# EasyEDA Pro project Speaker Switch 2.epro

# Schematic Speaker Switch
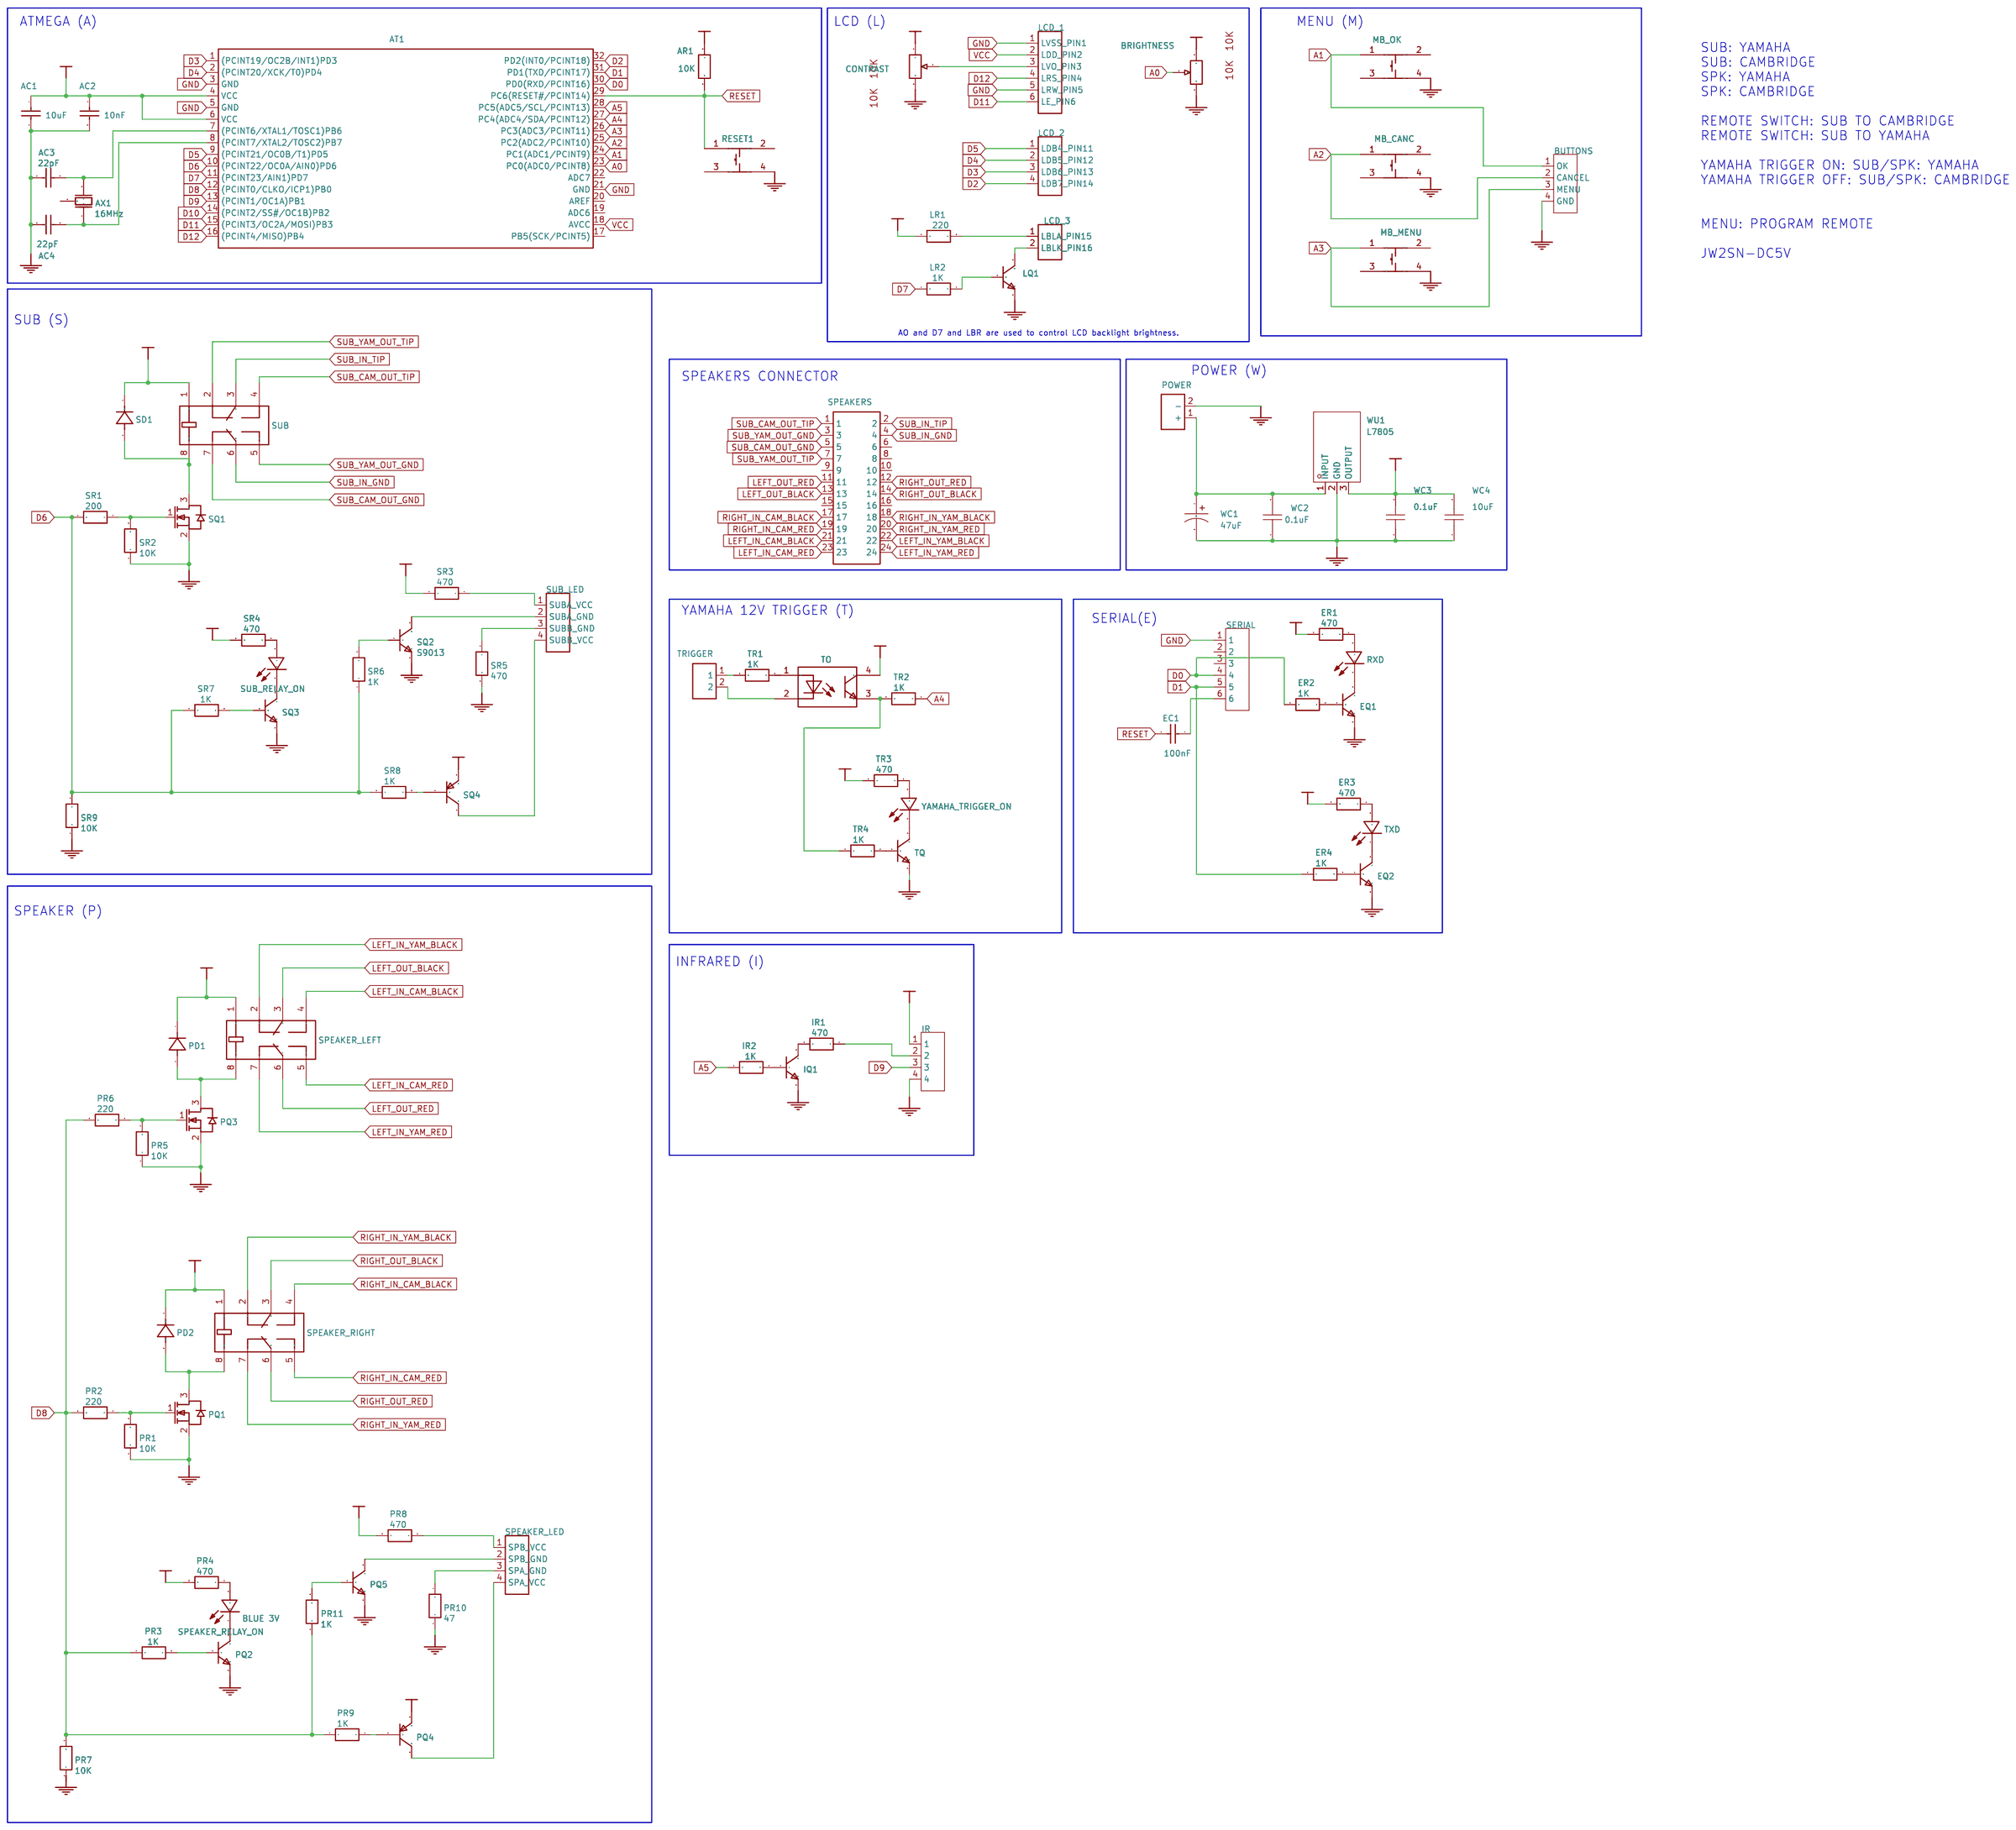
[diagram p0: schematic sheet]

## Parts
AC1  10uF  [C0805]
AC2  10nF  [C0805]
AC3  22pF  [C0805]
AC4  22pF  [C0805]
AR1  10K  [R0805]
AT1  ATMEGA328P-AU  [TQFP-32_L7.0-W7.0-P0.80-LS9.0-BL]
AX1  16MHz  [OSC-SMD_3P-L3.2-W1.3-P1.2-L]
BRIGHTNESS  potentiometer  [POTENTIOMETER]
BUTTONS  AXH-4A-11  [CONN-TH_KH-XH-4A-Z]
CONTRAST  potentiometer  [POTENTIOMETER]
EC1  100nF  [C0805]
EQ1  S9013  [SOT-23-3_L2.9-W1.6-P1.90-LS2.8-BR]
EQ2  S9013  [SOT-23-3_L2.9-W1.6-P1.90-LS2.8-BR]
ER1  470  [R0805]
ER2  1K  [R0805]
ER3  470  [R0805]
ER4  1K  [R0805]
IQ1  S9013  [SOT-23-3_L2.9-W1.6-P1.90-LS2.8-BR]
IR  AXH-4A-11  [CONN-TH_KH-XH-4A-Z]
IR1  470  [R0805]
IR2  1K  [R0805]
LCD_1  XD-XH-6A-G  [CONN-TH_XH-6A]
LCD_2  AXH-4A-11  [CONN-TH_KH-XH-4A-Z]
LCD_3  XH-D-2A  [CONN-TH_XH-2A]
LQ1  S9013  [SOT-23-3_L2.9-W1.6-P1.90-LS2.8-BR]
LR1  220  [R0805]
LR2  1K  [R0805]
MB_CANC  Push Button  [PUSH_BUTTON-SMD_4P]
MB_MENU  Push Button  [PUSH_BUTTON-SMD_4P]
MB_OK  Push Button  [PUSH_BUTTON-SMD_4P]
PD1  S1M_C3011098  [SMA_L4.3-W2.6-LS5.0-RD]
PD2  S1M_C3011098  [SMA_L4.3-W2.6-LS5.0-RD]
POWER  XH-D-2A  [CONN-TH_XH-2A]
PQ1  2N7002-G  [SOT-23-3_L2.9-W1.6-P1.90-LS2.8-BR]
PQ2  S9013  [SOT-23-3_L2.9-W1.6-P1.90-LS2.8-BR]
PQ3  2N7002-G  [SOT-23-3_L2.9-W1.6-P1.90-LS2.8-BR]
PQ4  S8550  [SOT-23-3_L2.9-W1.3-P1.90-LS2.4-BR]
PQ5  S9013  [SOT-23-3_L2.9-W1.6-P1.90-LS2.8-BR]
PR1  10K  [R0805]
PR2  220  [R0805]
PR3  1K  [R0805]
PR4  470  [R0805]
PR5  10K  [R0805]
PR6  220  [R0805]
PR7  10K  [R0805]
PR8  470  [R0805]
PR9  1K  [R0805]
PR10  47  [R0805]
PR11  1K  [R0805]
RESET1  Push Button  [PUSH_BUTTON-SMD_4P]
RXD  BLUE 3V  [LED0805-RD]
SD1  S1M_C3011098  [SMA_L4.3-W2.6-LS5.0-RD]
SERIAL  2.54-1*6  [HDR-TH_6P-P2.54-V-M]
SPEAKER_LED  AXH-4A-11  [CONN-TH_KH-XH-4A-Z]
SPEAKER_LEFT  JW2SN-DC5V  [RELAY-TH_JW2SN-DCXXV]
SPEAKER_RELAY_ON  BLUE 3V  [LED0805-RD]
SPEAKER_RIGHT  JW2SN-DC5V  [RELAY-TH_JW2SN-DCXXV]
SQ1  2N7002-G  [SOT-23-3_L2.9-W1.6-P1.90-LS2.8-BR]
SQ2  S9013  [SOT-23-3_L2.9-W1.6-P1.90-LS2.8-BR]
SQ3  S9013  [SOT-23-3_L2.9-W1.6-P1.90-LS2.8-BR]
SQ4  S8550  [SOT-23-3_L2.9-W1.3-P1.90-LS2.4-BR]
SR1  200  [R0805]
SR2  10K  [R0805]
SR3  470  [R0805]
SR4  470  [R0805]
SR5  470  [R0805]
SR6  1K  [R0805]
SR7  1K  [R0805]
SR8  1K  [R0805]
SR9  10K  [R0805]
SUB  JW2SN-DC5V  [RELAY-TH_JW2SN-DCXXV]
SUB_LED  AXH-4A-11  [CONN-TH_KH-XH-4A-Z]
SUB_RELAY_ON  BLUE 3V  [LED0805-RD]
TO  LTV-817S-TA1-C  [OPTO-SMD-4_L4.6-W6.5-P2.54-LS10.3-BL]
TQ  S9013  [SOT-23-3_L2.9-W1.6-P1.90-LS2.8-BR]
TR1  1K  [R0805]
TR2  1K  [R0805]
TR3  470  [R0805]
TR4  1K  [R0805]
TRIGGER  XH-2A_C3012117  [CONN-TH_XH-2A]
TXD  BLUE 3V  [LED0805-RD]
U1  SPEAKERS  [CONN-TH_C4255WV-2X12P]
WC1  47uF  [CAP-TH_BD6.3-P2.5-D0.5]
WC2  0.1uF  [C0805]
WC3  0.1uF  [C0805]
WC4  10uF  [C0805]
WU1  L7805  [TO-220-3_L10.0-W4.5-P2.54-L]
YAMAHA_TRIGGER_ON  BLUE 3V  [LED0805-RD]

## Library data of the parts
AC1 = 10uF: Supplier: LCSC; Manufacturer: YAGEO; Manufacturer Part: CC0805KKX7R9BB105; Supplier Part: C91185; JLCPCB Part Class: Extended Part; nameAlias: Capacitance; spicePre: C; spiceSymbolName: CC0805KKX7R9BB105
AC2 = 10nF: Supplier: LCSC; Manufacturer: YAGEO; Manufacturer Part: CC0805KKX7R9BB105; Supplier Part: C91185; JLCPCB Part Class: Extended Part; nameAlias: Capacitance; spicePre: C; spiceSymbolName: CC0805KKX7R9BB105
AC3 AC4 = 22pF: Supplier: LCSC; Manufacturer: YAGEO; Manufacturer Part: CC0805KKX7R9BB105; Supplier Part: C91185; JLCPCB Part Class: Extended Part; nameAlias: Capacitance; spicePre: C; spiceSymbolName: CC0805KKX7R9BB105
AR1 ER2 ER4 IR2 PR3 PR9 PR11 SR3 SR6-SR8 TR1 TR2 TR4 = 1K: Supplier: Mouser; Supplier Part: 756-WCR0805-1K0FI; Manufacturer: Walsin Tech Corp; Manufacturer Part: WR08X102 JTL; nameAlias: Resistance (Ohms); Contributor: LCSC; spicePre: R; spiceSymbolName: WR08X102 JTL; Package Display: No
AT1 = ATMEGA328P-AU: Supplier: LCSC; Manufacturer: MICROCHIP; Supplier Part: C14877; JLCPCB Part Class: Basic Part; spicePre: U
AX1 = 16MHz: Supplier: LCSC; Supplier Part: C341521; Manufacturer: Murata Electronics; Manufacturer Part: CSTNE16M0V530000R0; JLCPCB Part Class: Extended Part; nameAlias: Frequency; Contributor: LCSC; spicePre: X; spiceSymbolName: CSTNE16M0V530000R0
BRIGHTNESS CONTRAST = potentiometer: Contributor: sausnet 1975; spicePre: U
BUTTONS = AXH-4A-11-BTN: Pins Structure:1x4P Pitch:2.5mm Mounting Type:Through Hole Reference Series:XH Number of Pins:4P Number of Rows:1 Number of PINs Per Row:4 Row Spacing:2.5mm Current Rating:2A Contact Material:Brass Contact Plating:Tin Operating Temperature:-25℃~+85℃ Opera; LCSC Part Name: 1x4P 间距:2.5mm 直插 系列:XH; Supplier Part: C42422439; Manufacturer: JXTCONN(聚兴泰); Supplier Footprint: 插件,P=2.54mm; JLCPCB Part Class: Extended Part; Datasheet: https://item.szlcsc.com/datasheet/AXH-4A-11/44442050.html; Supplier: LCSC; Pins Structure: 1x4P; Pitch: 2.5mm; Mounting Type: Through Hole; Reference Series: XH; Number of Pins: 4P; Number of Rows: 1; Number of PINs Per Row: 4; Row Spacing: 2.5mm; Current Rating: 2A; Contact Material: Brass; Contact Plating: Tin; Operating Temperature: -25℃~+85℃; Voltage Rating: 250V; Plastic Material: PA66; Flame Retardant Rating: UL94V-0; Color: White; Z-Height of the Board: 7mm; X-Length of Bottom Edge on Board (Spacing Line): 12.5mm; Y-Width of Bottom Edge on Board: 5.9mm
EC1 = 100nF: Supplier: LCSC; Manufacturer: YAGEO; Manufacturer Part: CC0805KKX7R9BB105; Supplier Part: C91185; JLCPCB Part Class: Extended Part; nameAlias: Capacitance; spicePre: C; spiceSymbolName: CC0805KKX7R9BB105
EQ1 EQ2 IQ1 LQ1 PQ2 PQ5 SQ2 SQ3 TQ = S9013: Supplier: LCSC; Manufacturer: CJ; Manufacturer Part: S9013 120-200; Supplier Part: C107404; JLCPCB Part Class: Extended Part; spicePre: Q; spiceSymbolName: S9013 120-200; Package Display: No
ER1 ER3 IR1 LR1 PR2 PR4 PR6 PR8 PR10 SR1 SR4 TR3 = 220: Supplier: Mouser; Supplier Part: WCR0805-220RFI; Manufacturer: Walsin Tech Corp; Manufacturer Part: WR08X102 JTL; nameAlias: Resistance (Ohms); Contributor: LCSC; spicePre: R; spiceSymbolName: WR08X102 JTL; Package Display: No
IR LCD_2 = AXH-4A-11: Pins Structure:1x4P Pitch:2.5mm Mounting Type:Through Hole Reference Series:XH Number of Pins:4P Number of Rows:1 Number of PINs Per Row:4 Row Spacing:2.5mm Current Rating:2A Contact Material:Brass Contact Plating:Tin Operating Temperature:-25℃~+85℃ Opera; LCSC Part Name: 1x4P 间距:2.5mm 直插 系列:XH; Supplier Part: C42422439; Manufacturer: JXTCONN(聚兴泰); Supplier Footprint: 插件,P=2.54mm; JLCPCB Part Class: Extended Part; Datasheet: https://item.szlcsc.com/datasheet/AXH-4A-11/44442050.html; Supplier: LCSC; Pins Structure: 1x4P; Pitch: 2.5mm; Mounting Type: Through Hole; Reference Series: XH; Number of Pins: 4P; Number of Rows: 1; Number of PINs Per Row: 4; Row Spacing: 2.5mm; Current Rating: 2A; Contact Material: Brass; Contact Plating: Tin; Operating Temperature: -25℃~+85℃; Voltage Rating: 250V; Plastic Material: PA66; Flame Retardant Rating: UL94V-0; Color: White; Z-Height of the Board: 7mm; X-Length of Bottom Edge on Board (Spacing Line): 12.5mm; Y-Width of Bottom Edge on Board: 5.9mm
LCD_1 = XD-XH-6A-G: Supplier: LCSC; Supplier Part: C17700950; Manufacturer: XUNDA(讯答); JLCPCB Part Class: Extended Part; Contributor: lcsc; spicePre: U
LCD_3 = XH-D-2A: Supplier: LCSC; Supplier Part: C5160911; Manufacturer: DEALON(德艺隆); JLCPCB Part Class: Extended Part; Contributor: lcsc; spicePre: C
LR2 = 1K: Supplier: Mouser; Supplier Part: 756-WCR0805-470RFI; Manufacturer: Walsin Tech Corp; Manufacturer Part: WR08X102 JTL; nameAlias: Resistance (Ohms); Contributor: LCSC; spicePre: R; spiceSymbolName: WR08X102 JTL; Package Display: No
MB_CANC MB_MENU MB_OK RESET1 = Push Button: Supplier: Office; Contributor: Smart; spicePre: S
PD1 PD2 SD1 = S1M_C3011098: Supplier: Mouser; Supplier Part: 603-S1M; Manufacturer: YAGEO; Manufacturer Part: S1M; JLCPCB Part Class: Extended Part; Contributor: lcsc; spicePre: D
POWER = XH-D-2A-POWER: Supplier: LCSC; Supplier Part: C5160911; Manufacturer: DEALON(德艺隆); JLCPCB Part Class: Extended Part
PQ1 PQ3 SQ1 = 2N7002-G: Supplier: Mouser; Supplier Part: 637-2N7002; Manufacturer: Diotec Semiconductor; JLCPCB Part Class: Extended Part; Contributor: LCSC; spicePre: Q
PQ4 SQ4 = S8550: Supplier: LCSC; Supplier Part: C2828467; Manufacturer: CBI(创基); Contributor: LCSC; spicePre: Q; spiceSymbolName: S8550_C2828467
PR1 PR5 SR2 SR9 = 10K: Supplier: Mouser; Supplier Part: WCR0805-10KFI; Manufacturer: Walsin Tech Corp; Manufacturer Part: WR08X102 JTL; nameAlias: Resistance (Ohms); Contributor: LCSC; spicePre: R; spiceSymbolName: WR08X102 JTL; Package Display: No
PR7 = 10K: Supplier: LCSC; Supplier Part: C384174; Manufacturer: Walsin Tech Corp; Manufacturer Part: WR08X102 JTL; nameAlias: Resistance (Ohms); Contributor: LCSC; spicePre: R; spiceSymbolName: WR08X102 JTL; Package Display: No
RXD SPEAKER_RELAY_ON SUB_RELAY_ON TXD YAMAHA_TRIGGER_ON = BLUE 3V: Supplier: LCSC; Manufacturer: NATIONSTAR; Manufacturer Part: FC-1608YOXK-600H08; Supplier Part: C108553; JLCPCB Part Class: Extended Part; Contributor: LCSC; spicePre: L; spiceSymbolName: FC-1608YOXK-600H08
SERIAL = 2.54-1*6: Pin Structure:1x6P Pitch:2.54mm Circluar Pins/Square Pins:Pin Header Mounting Type:Through Hole Number of Rows:1 Number of Pins:6P Current Rating:2.5A Length of Mating Pin:6mm Insulation Height:2.54mm Length of End Connection Pin:3mm Contact Material:Bras; LCSC Part Name: 1x6P 间距:2.54mm 方针 直插; Supplier Part: C5156615; Manufacturer: ZHOURI(洲日); Supplier Footprint: 插件,P=2.54mm; JLCPCB Part Class: Extended Part; Datasheet: https://item.szlcsc.com/datasheet/2.54-1*6/5790715.html; Supplier: LCSC; Pin Structure: 1x6P; Pitch: 2.54mm; Circluar Pins/Square Pins: Pin Header; Mounting Type: Through Hole; Number of Rows: 1; Number of Pins: 6P; Current Rating: 2.5A; Length of Mating Pin: 6mm; Insulation Height: 2.54mm; Length of End Connection Pin: 3mm; Contact Material: Brass; Contact Plating: Gold; Operating Temperature: -40℃~+105℃
SPEAKER_LED SUB_LED = AXH-4A-11: Supplier: LCSC; Supplier Part: C42422439; Manufacturer: JXTCONN(聚兴泰); JLCPCB Part Class: Extended Part; Contributor: lcsc; spicePre: C
SPEAKER_LEFT SPEAKER_RIGHT SUB = JW2SN-DC5V: Supplier: Mouser; Supplier Part: 769-JW2SN-DC5V; Manufacturer: PANASONIC(松下); JLCPCB Part Class: Extended Part; Contributor: LCSC; spicePre: K
SR5 = 300: Supplier: LCSC; Supplier Part: C384174; Manufacturer: Walsin Tech Corp; Manufacturer Part: WR08X102 JTL; nameAlias: Resistance (Ohms); Contributor: LCSC; spicePre: R; spiceSymbolName: WR08X102 JTL; Package Display: No
TO = LTV-817S-TA1-C: Supplier: Mouser; Manufacturer: LITEON(光宝); JLCPCB Part Class: Basic Part; spicePre: U
TRIGGER = XH-2A_C3012117: Supplier: LCSC; Supplier Part: C3012117; Manufacturer: HCTL(华灿天禄); Manufacturer Part: XH-2A; JLCPCB Part Class: Extended Part; Contributor: lcsc; spicePre: C
U1 = SPEAKERS: Supplier: LCSC; Supplier Part: C9900031500; Manufacturer: null; Manufacturer Part: ATX-24PIN; JLCPCB Part Class: Extended Part; Contributor: lcsc; spicePre: U; spiceSymbolName: ATX-24PIN
WC1 = 50V47uF CD288: Capacitance:47uF Tolerance:±20% Tolerance:±20% Voltage Rating:50V Pin Spacing:2.5mm Diameter:6.3mm Height - Seated (Max):12mm Operating Temperature:-40℃~+105℃ Operating Temperature:-40℃~+105℃; LCSC Part Name: 47uF ±20% 50V; Supplier Part: C2960223; Manufacturer: HRK(鸿瑞凯电子); Supplier Footprint: 插件,D6.3xL12mm; JLCPCB Part Class: Extended Part; Supplier: LCSC; Tolerance: ±20%; Voltage Rating: 50V; Pin Spacing: 2.5mm; Diameter: 6.3mm; Height - Seated (Max): 12mm; Operating Temperature: -40℃~+105℃
WC2-WC4 = CT41G-0805-2X1-50V-0.1uF-K(N): Capacitance:100nF Tolerance:±10% Tolerance:±10% Voltage Rating:50V Temperature Coefficient:-; LCSC Part Name: 100nF ±10% 50V; Supplier Part: C126469; Manufacturer: TORCH(火炬); Supplier Footprint: 0805; JLCPCB Part Class: Extended Part; Datasheet: https://item.szlcsc.com/datasheet/CT41G-0805-2X1-50V-0.1uF-K(N)/137749.html; Supplier: LCSC; Tolerance: ±10%; Voltage Rating: 50V
WU1 = L7805_C22378639: Output Type:Fixed Voltage - Supply:20V Output Voltage:5V Output Voltage:5V Output Current:1.2A Power Supply Rejection Ratio (PSRR):73dB@(120Hz) Voltage Dropout:2V@(1A) standby current:500uA Noise:42uV Features:Short Circuit Protection Operating Temperatur; LCSC Part Name: 1.2A 5V稳压管; Supplier Part: C22378639; Manufacturer: OSEN(欧芯); Supplier Footprint: TO-220ST; JLCPCB Part Class: Extended Part; Datasheet: https://item.szlcsc.com/datasheet/L7805/23899839.html; Supplier: LCSC; Output Type: Fixed; Voltage - Supply: 20V; Output Voltage: 5V; Output Current: 1.2A; Power Supply Rejection Ratio (PSRR): 73dB@(120Hz); Voltage Dropout: 2V@(1A); standby current: 500uA; Noise: 42uV; Features: Short Circuit Protection; Operating Temperature: 0℃~+125℃@(Tj); Output Configuration: Positive; Number of Outputs: 1

## Nets
GND: AC1.2 AC2.2 AC3.1 AC4.1 AT1.3(GND) AT1.5(GND) AT1.21(GND) BRIGHTNESS.1 BUTTONS.4(GND) CONTRAST.3 EQ1.2 EQ2.2 IQ1.2 IR.4 LCD_1.1(LVSS_PIN1) LCD_1.5(LRW_PIN5) LQ1.2 MB_CANC.4 MB_MENU.4 MB_OK.4 POWER.2(-) PQ1.2(S) PQ2.2 PQ3.2(S) PQ5.2 PR1.1 PR5.1 PR7.1 PR10.2 RESET1.4 SERIAL.1 SQ1.2(S) SQ2.2 SQ3.2 SR2.1 SR5.2 SR9.1 TQ.2 WC1.2 WC2.1 WC3.1 WC4.1 WU1.2(GND)
VCC: AC1.1 AC2.1 AR1.2 AT1.4(VCC) AT1.6(VCC) AT1.18(AVCC) BRIGHTNESS.3 CONTRAST.1 ER1.2 ER3.2 IR.1 LCD_1.2(LDD_PIN2) LR1.1 PD1.1(C) PD2.1(C) PQ4.2(E) PR4.2 PR8.2 SD1.1(C) SPEAKER_LEFT.1 SPEAKER_RIGHT.1 SQ4.2(E) SR3.2 SR4.2 SUB.1 TO.4 TR3.2 WC3.2 WC4.2 WU1.3(OUTPUT)
A0: AT1.23(PC0(ADC0/PCINT8)) BRIGHTNESS.2
A1: AT1.24(PC1(ADC1/PCINT9)) BUTTONS.1(OK) MB_OK.1
A2: AT1.25(PC2(ADC2/PCINT10)) BUTTONS.2(CANCEL) MB_CANC.1
A3: AT1.26(PC3(ADC3/PCINT11)) BUTTONS.3(MENU) MB_MENU.1
A4: AT1.27(PC4(ADC4/SDA/PCINT12)) TR2.1
A5: AT1.28(PC5(ADC5/SCL/PCINT13)) IR2.1
D0: AT1.30(PD0(RXD/PCINT16)) ER2.1 SERIAL.4
D1: AT1.31(PD1(TXD/PCINT17)) ER4.1 SERIAL.5
D2: AT1.32(PD2(INT0/PCINT18)) LCD_2.4(LDB7_PIN14)
D3: AT1.1((PCINT19/OC2B/INT1)PD3) LCD_2.3(LDB6_PIN13)
D4: AT1.2((PCINT20/XCK/T0)PD4) LCD_2.2(LDB5_PIN12)
D5: AT1.9((PCINT21/OC0B/T1)PD5) LCD_2.1(LDB4_PIN11)
D6: AT1.10((PCINT22/OC0A/AIN0)PD6) SR1.2 SR6.1 SR7.1 SR8.1 SR9.2
D7: AT1.11((PCINT23/AIN1)PD7) LR2.1
D8: AT1.12((PCINT0/CLKO/ICP1)PB0) PR2.2 PR3.1 PR6.2 PR7.2 PR9.1 PR11.1
D9: AT1.13((PCINT1/OC1A)PB1) IR.3
D10: AT1.14((PCINT2/SS#/OC1B)PB2)
D11: AT1.15((PCINT3/OC2A/MOSI)PB3) LCD_1.6(LE_PIN6)
D12: AT1.16((PCINT4/MISO)PB4) LCD_1.4(LRS_PIN4)
LEFT_IN_CAM_BLACK: SPEAKER_LEFT.4 U1.21
LEFT_IN_CAM_RED: SPEAKER_LEFT.5 U1.23
LEFT_IN_YAM_BLACK: SPEAKER_LEFT.2 U1.22
LEFT_IN_YAM_RED: SPEAKER_LEFT.7 U1.24
LEFT_OUT_BLACK: SPEAKER_LEFT.3 U1.13
LEFT_OUT_RED: SPEAKER_LEFT.6 U1.11
RESET: AR1.1 AT1.29(PC6(RESET#/PCINT14)) EC1.2 RESET1.1
RIGHT_IN_CAM_BLACK: SPEAKER_RIGHT.4 U1.17
RIGHT_IN_CAM_RED: SPEAKER_RIGHT.5 U1.19
RIGHT_IN_YAM_BLACK: SPEAKER_RIGHT.2 U1.18
RIGHT_IN_YAM_RED: SPEAKER_RIGHT.7 U1.20
RIGHT_OUT_BLACK: SPEAKER_RIGHT.3 U1.14
RIGHT_OUT_RED: SPEAKER_RIGHT.6 U1.12
SUB_CAM_OUT_GND: SUB.7 U1.5
SUB_CAM_OUT_TIP: SUB.4 U1.1
SUB_IN_GND: SUB.6 U1.4
SUB_IN_TIP: SUB.3 U1.2
SUB_YAM_OUT_GND: SUB.5 U1.3
SUB_YAM_OUT_TIP: SUB.2 U1.7
$1N2: AC4.2 AT1.8((PCINT7/XTAL2/TOSC2)PB7) AX1.1(OSC1)
$1N3: AC3.2 AT1.7((PCINT6/XTAL1/TOSC1)PB6) AX1.3(OSC2)
$1N9: LCD_3.2(LBLK_PIN16) LQ1.3
$1N11: LQ1.1 LR2.2
$1N13: LCD_3.1(LBLA_PIN15) LR1.2
$1N18: CONTRAST.2 LCD_1.3(LVO_PIN3)
$1N24: SQ2.3 SUB_LED.2(SUBA_GND)
$1N25: SR3.1 SUB_LED.1(SUBA_VCC)
$1N27: SQ2.1 SR6.2
$1N28: SQ4.1(B) SR8.2
$1N29: PQ4.1(B) PR9.2
$1N30: PQ5.1 PR11.2
$1N32: PR8.1 SPEAKER_LED.1(SPB_VCC)
$1N33: PQ5.3 SPEAKER_LED.2(SPB_GND)
$1N38: EC1.1 SERIAL.6
$1N45: TO.2 TRIGGER.2
$1N46: TO.3 TR2.2 TR4.1
$1N47: TR1.2 TRIGGER.1
$1N48: TO.1 TR1.1
$1N53: SD1.2(A) SQ1.3(D) SUB.8
$1N55: SQ3.1 SR7.2
$1N60: SR5.1 SUB_LED.3(SUBB_GND)
$1N61: SQ4.3(C) SUB_LED.4(SUBB_VCC)
$1N63: PD1.2(A) PQ3.3(D) SPEAKER_LEFT.8
$1N77: PD2.2(A) PQ1.3(D) SPEAKER_RIGHT.8
$1N80: PR10.1 SPEAKER_LED.3(SPA_GND)
$1N81: PQ4.3(C) SPEAKER_LED.4(SPA_VCC)
$1N82: PQ2.1 PR3.2
$1N84: PQ3.1(G) PR5.2 PR6.1
$1N86: PQ1.1(G) PR1.2 PR2.1
$1N88: SQ1.1(G) SR1.1 SR2.2
$1N2026: SR4.1 SUB_RELAY_ON.2(A)
$1N2027: SQ3.3 SUB_RELAY_ON.1(K)
$1N2090: PR4.1 SPEAKER_RELAY_ON.2(A)
$1N2093: PQ2.3 SPEAKER_RELAY_ON.1(K)
$1N2094: TR3.1 YAMAHA_TRIGGER_ON.2(A)
$1N2095: TQ.1 TR4.2
$1N2096: TQ.3 YAMAHA_TRIGGER_ON.1(K)
$1N2101: EQ1.1 ER2.2
$1N2102: ER1.1 RXD.2(A)
$1N2103: EQ1.3 RXD.1(K)
$1N2106: ER3.1 TXD.2(A)
$1N2109: EQ2.1 ER4.2
$1N2110: EQ2.3 TXD.1(K)
$1N11660: IQ1.1 IR2.2
$1N11678: IQ1.3 IR1.2
$1N11682: IR.2 IR1.1
PWR_IN: POWER.1(+) WC1.1 WC2.2 WU1.1(INPUT)

Not connected (* = marked no-connect by the designer): AT1 17(PB5(SCK/PCINT5)) 19(ADC6) 20(AREF) 22(ADC7); AX1 2(GND); MB_CANC 2 3; MB_MENU 2 3; MB_OK 2 3; RESET1 2 3; SERIAL 2 3; U1 6 8 9 10 15 16

## Notes on the sheet
- ATMEGA (A)
- LCD (L)
- MENU (M)
- SUB: YAMAHA
  SUB: CAMBRIDGE
  SPK: YAMAHA
  SPK: CAMBRIDGE
  REMOTE SWITCH: SUB TO CAMBRIDGE
  REMOTE SWITCH: SUB TO YAMAHA
  YAMAHA TRIGGER ON: SUB/SPK: YAMAHA
  YAMAHA TRIGGER OFF: SUB/SPK: CAMBRIDGE
  MENU: PROGRAM REMOTE
  JW2SN-DC5V
- SUB (S)
- AO and D7 and LBR are used to control LCD backlight brightness.
- SPEAKERS CONNECTOR
- POWER (W)
- YAMAHA 12V TRIGGER (T)
- SERIAL(E)
- SPEAKER (P)
- INFRARED (I)

# Board PCB
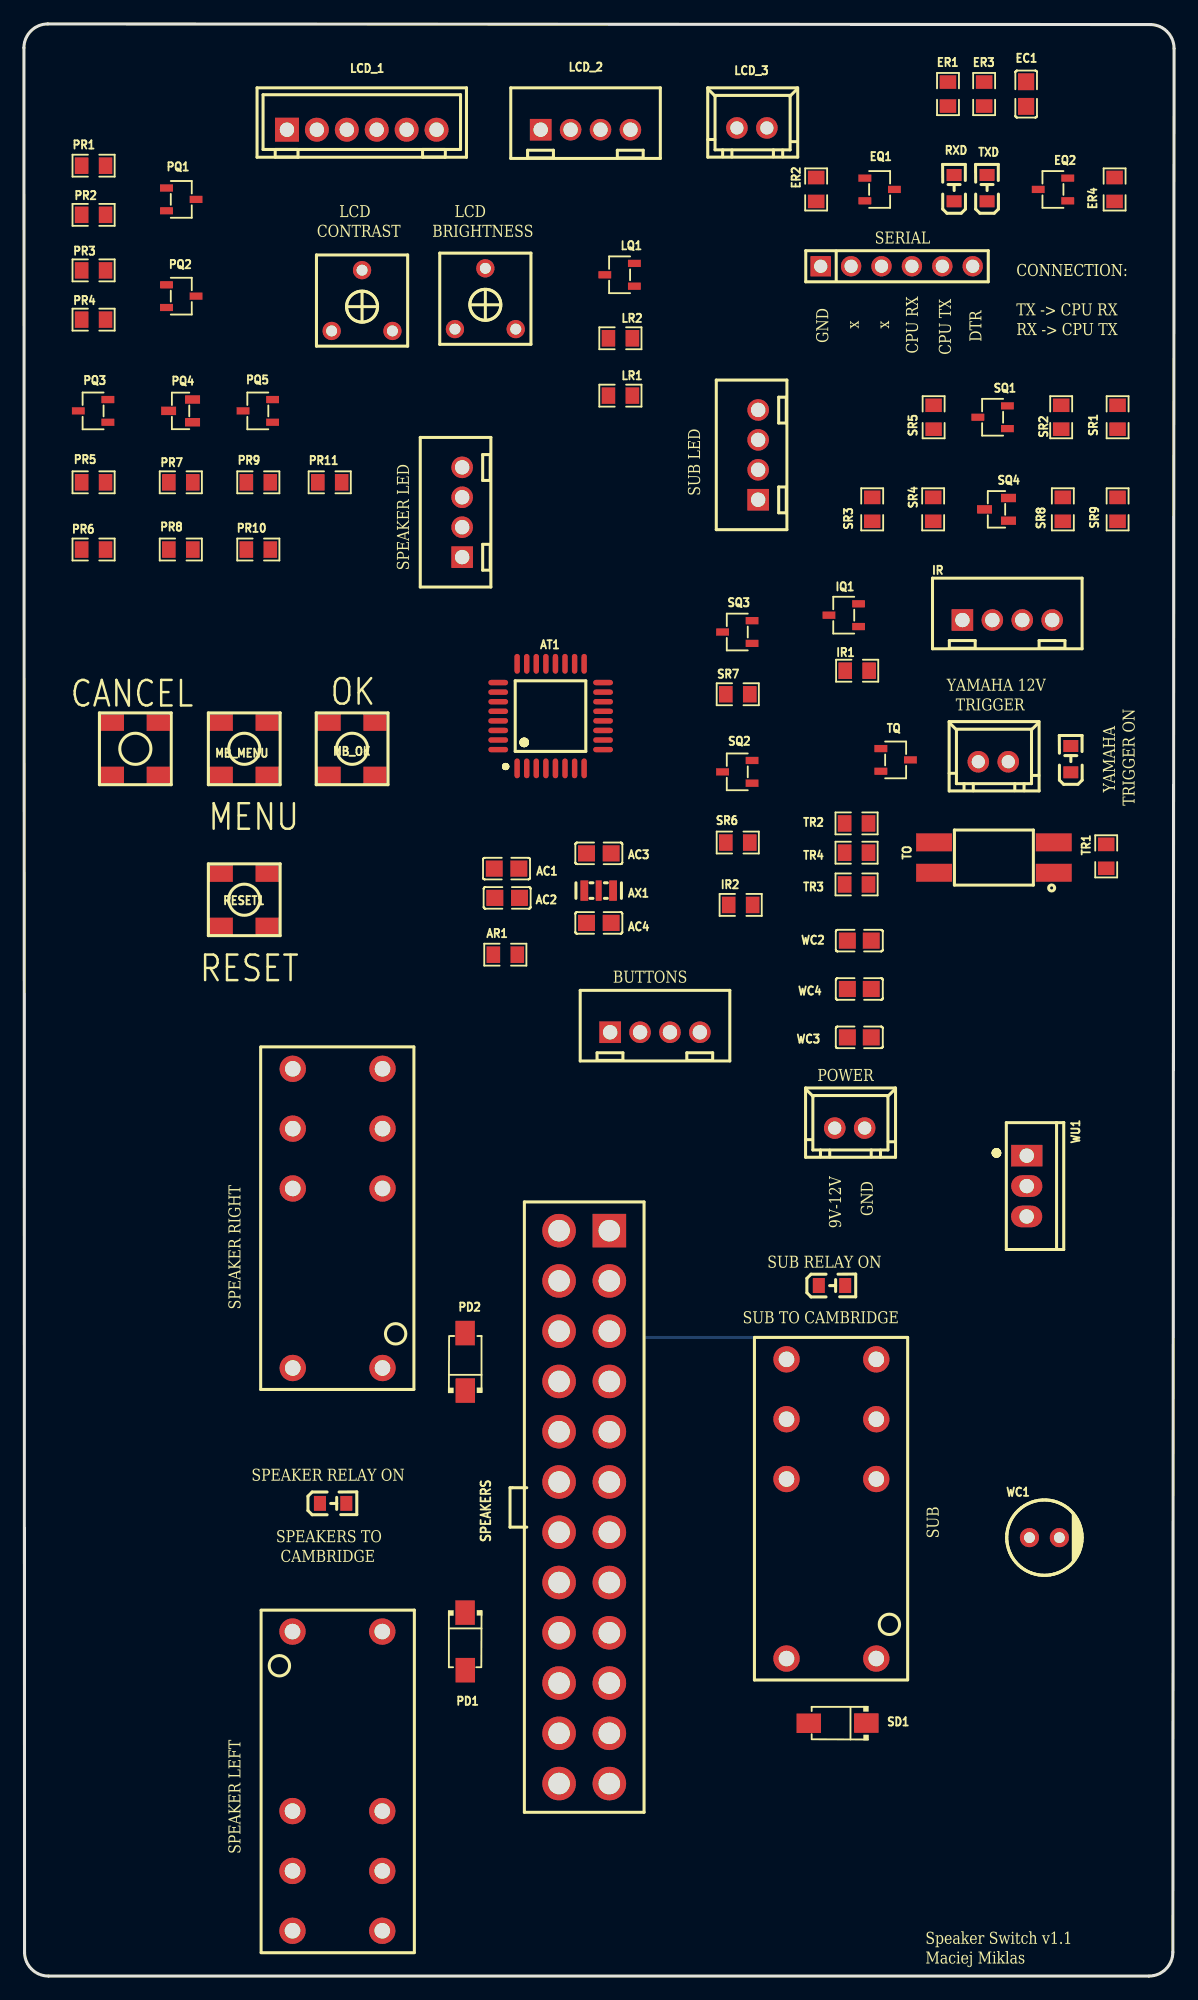
[diagram p1: board, top side]
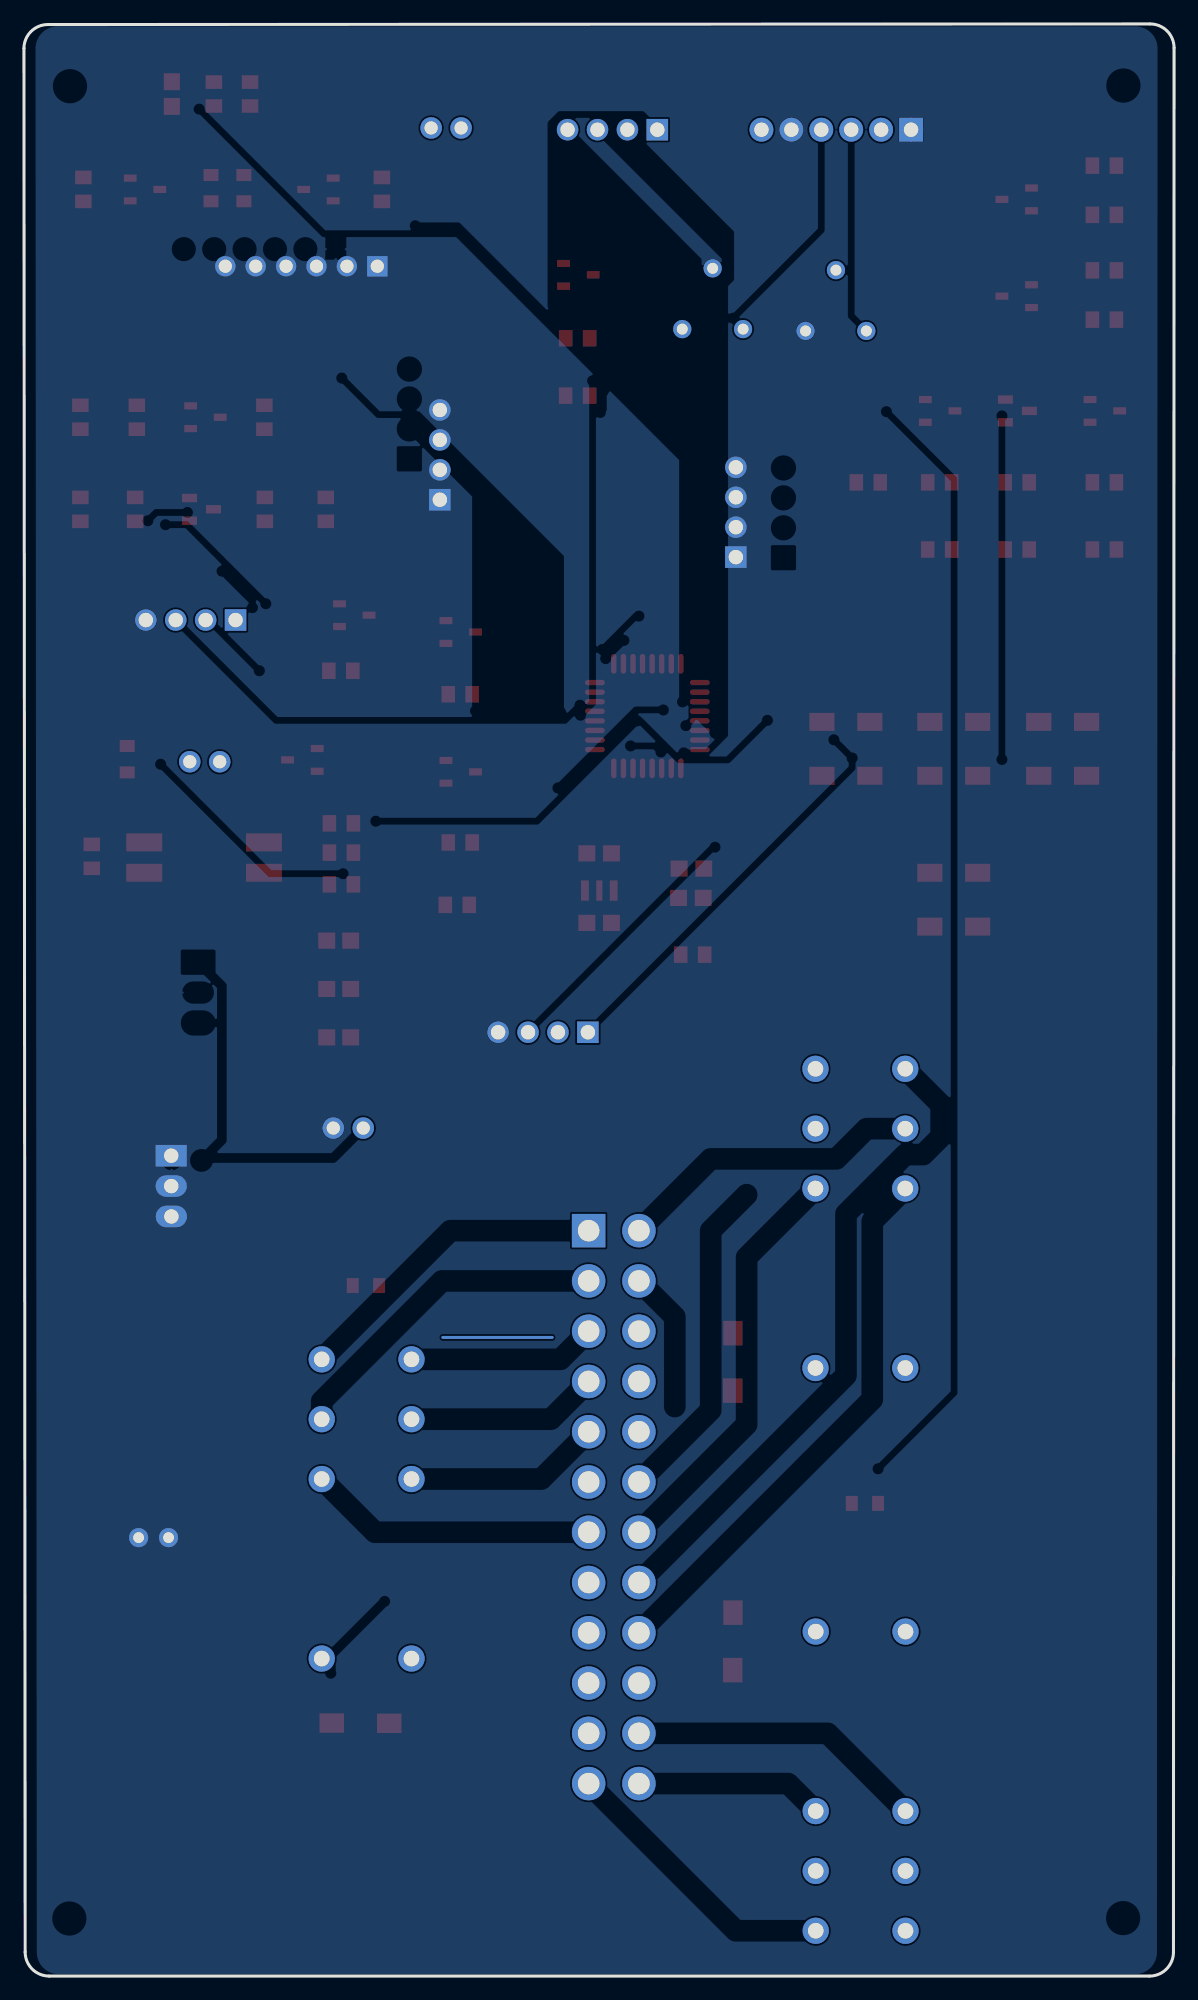
[diagram p2: board, bottom side, seen from below]

Outline 96.11 x 163.11 mm; copper layers: Top Layer, Bottom Layer. Coordinates in mm from the lower left corner of the outline.
Outline path: 0,161.11 arc(0.59,162.53) 2,163.11 94.11,163.06 arc(95.52,162.48) 96.11,161.06 96,2 arc(95.42,0.59) 94,0 2.05,0 arc(0.64,0.59) 0.05,2 0,161.11
Stack: Top Layer 0.035mm / Dielectric1 1.51mm FR4 er 4.5 / Bottom Layer 0.035mm

## Design rules (mm)
template: User Custom Config
spacing Default (default): track to track 0.152, other pairs 0 to 0.152
track width Default (default): min 0.254, default 0.254, max 25.4
track width power: min 0.5, default 0.5, max 2.54
track width speaker: min 1.5, default 1.5, max 2.54
track width mega_thick: min 5, default 5, max 5
differential pair differentialPair (default): width min 0.127, default 0.254, max 2.54; gap min 0.152, default 0.152
via Default (default): diameter min 0.61, default 0.61, max 100.025; hole min 0.305, default 0.305, max 59.995
net GND uses power
net VCC uses power
net SUB_IN_TIP uses speaker
net SUB_IN_GND uses speaker
net RIGHT_OUT_BLACK uses speaker
net LEFT_OUT_BLACK uses speaker
net RIGHT_OUT_RED uses speaker
net LEFT_OUT_RED uses speaker
net PWR_IN uses power

## Placement (name value [footprint] x y rotation side)
AC1  10uF  [C0805]  40.33 92.54 180 top
AC2  10nF  [C0805]  40.38 90.09 180 top
AC3  22pF  [C0805]  48.04 93.81 0 top
AC4  22pF  [C0805]  48.04 88 0 top
AR1  10K  [R0805]  40.22 85.35 0 top
AT1  ATMEGA328P-AU  [TQFP-32_L7.0-W7.0-P0.80-LS9.0-BL]  44.01 105.28 0 top
AX1  16MHz  [OSC-SMD_3P-L3.2-W1.3-P1.2-L]  48.03 90.7 180 top
BRIGHTNESS  potentiometer  [POTENTIOMETER]  38.56 137.61 0 top
BUTTONS  AXH-4A-11  [CONN-TH_KH-XH-4A-Z]  52.73 78.86 0 top
CONTRAST  potentiometer  [POTENTIOMETER]  28.25 137.46 0 top
EC1  100nF  [C0805]  83.75 157.25 90 top
EQ1  S9013  [SOT-23-3_L2.9-W1.6-P1.90-LS2.8-BR]  71.5 149.28 180 top
EQ2  S9013  [SOT-23-3_L2.9-W1.6-P1.90-LS2.8-BR]  85.99 149.28 0 top
ER1  470  [R0805]  77.21 157.25 90 top
ER2  1K  [R0805]  66.2 149.28 90 top
ER3  470  [R0805]  80.23 157.25 90 top
ER4  1K  [R0805]  91.14 149.28 270 top
IQ1  S9013  [SOT-23-3_L2.9-W1.6-P1.90-LS2.8-BR]  68.5 113.71 0 top
IR  AXH-4A-11  [CONN-TH_KH-XH-4A-Z]  82.17 113.3 0 top
IR1  470  [R0805]  69.62 109.07 0 top
IR2  1K  [R0805]  59.89 89.5 0 top
LCD_1  XD-XH-6A-G  [CONN-TH_XH-6A]  28.23 154.28 0 top
LCD_2  AXH-4A-11  [CONN-TH_KH-XH-4A-Z]  46.93 154.28 0 top
LCD_3  XH-D-2A  [CONN-TH_XH-2A]  60.83 154.42 0 top
LQ1  S9013  [SOT-23-3_L2.9-W1.6-P1.90-LS2.8-BR]  49.77 142.15 0 top
LR1  220  [R0805]  49.84 132.06 0 top
LR2  1K  [R0805]  49.84 136.85 0 top
MB_CANC  Push Button  [PUSH_BUTTON-SMD_4P]  9.31 102.55 0 top
MB_MENU  Push Button  [PUSH_BUTTON-SMD_4P]  18.41 102.55 0 top
MB_OK  Push Button  [PUSH_BUTTON-SMD_4P]  27.42 102.55 0 top
PD1  S1M_C3011098  [SMA_L4.3-W2.6-LS5.0-RD]  36.87 27.96 270 top
PD2  S1M_C3011098  [SMA_L4.3-W2.6-LS5.0-RD]  36.87 51.32 90 top
POWER  XH-D-2A  [CONN-TH_XH-2A]  69 70.86 0 top
PQ1  2N7002-G  [SOT-23-3_L2.9-W1.6-P1.90-LS2.8-BR]  13.15 148.45 180 top
PQ2  S9013  [SOT-23-3_L2.9-W1.6-P1.90-LS2.8-BR]  13.15 140.37 180 top
PQ3  2N7002-G  [SOT-23-3_L2.9-W1.6-P1.90-LS2.8-BR]  5.78 130.78 0 top
PQ4  S8550  [SOT-23-3_L2.9-W1.3-P1.90-LS2.4-BR]  13.09 130.78 0 top
PQ5  S9013  [SOT-23-3_L2.9-W1.6-P1.90-LS2.8-BR]  19.54 130.78 0 top
PR1  10K  [R0805]  5.82 151.27 180 top
PR2  220  [R0805]  5.82 147.16 0 top
PR3  1K  [R0805]  5.82 142.52 0 top
PR4  470  [R0805]  5.82 138.41 0 top
PR5  10K  [R0805]  5.82 124.81 180 top
PR6  220  [R0805]  5.82 119.2 0 top
PR7  10K  [R0805]  13.11 124.81 0 top
PR8  470  [R0805]  13.11 119.2 0 top
PR9  1K  [R0805]  19.58 124.81 0 top
PR10  47  [R0805]  19.58 119.2 0 top
PR11  1K  [R0805]  25.55 124.81 0 top
RESET1  Push Button  [PUSH_BUTTON-SMD_4P]  18.41 89.94 0 top
RXD  BLUE 3V  [LED0805-RD]  77.72 149.4 90 top
SD1  S1M_C3011098  [SMA_L4.3-W2.6-LS5.0-RD]  67.98 21.13 180 top
SERIAL  2.54-1*6  [HDR-TH_6P-P2.54-V-M]  72.93 142.87 0 top
SPEAKER_LED  AXH-4A-11  [CONN-TH_KH-XH-4A-Z]  36.62 122.31 90 top
SPEAKER_LEFT  JW2SN-DC5V  [RELAY-TH_JW2SN-DCXXV]  26.19 16.29 270 top
SPEAKER_RELAY_ON  BLUE 3V  [LED0805-RD]  25.83 39.5 0 top
SPEAKER_RIGHT  JW2SN-DC5V  [RELAY-TH_JW2SN-DCXXV]  26.21 63.31 90 top
SQ1  2N7002-G  [SOT-23-3_L2.9-W1.6-P1.90-LS2.8-BR]  80.94 130.25 0 top
SQ2  S9013  [SOT-23-3_L2.9-W1.6-P1.90-LS2.8-BR]  59.61 100.62 0 top
SQ3  S9013  [SOT-23-3_L2.9-W1.6-P1.90-LS2.8-BR]  59.61 112.3 0 top
SQ4  S8550  [SOT-23-3_L2.9-W1.3-P1.90-LS2.4-BR]  81.27 122.56 0 top
SR1  200  [R0805]  91.39 130.25 90 top
SR2  10K  [R0805]  86.67 130.25 270 top
SR3  470  [R0805]  70.88 122.56 270 top
SR4  470  [R0805]  75.97 122.56 90 top
SR5  470  [R0805]  76.01 130.25 270 top
SR6  1K  [R0805]  59.65 94.72 0 top
SR7  1K  [R0805]  59.65 107.11 0 top
SR8  1K  [R0805]  86.81 122.56 270 top
SR9  10K  [R0805]  91.39 122.56 270 top
SUB  JW2SN-DC5V  [RELAY-TH_JW2SN-DCXXV]  67.47 39.03 90 top
SUB_LED  AXH-4A-11  [CONN-TH_KH-XH-4A-Z]  61.35 127.11 90 top
SUB_RELAY_ON  BLUE 3V  [LED0805-RD]  67.52 57.7 0 top
TO  LTV-817S-TA1-C  [OPTO-SMD-4_L4.6-W6.5-P2.54-LS10.3-BL]  81.05 93.46 90 top
TQ  S9013  [SOT-23-3_L2.9-W1.6-P1.90-LS2.8-BR]  72.84 101.62 180 top
TR1  1K  [R0805]  90.43 93.56 90 top
TR2  1K  [R0805]  69.58 96.31 0 top
TR3  470  [R0805]  69.58 91.21 0 top
TR4  1K  [R0805]  69.58 93.87 180 top
TRIGGER  XH-2A_C3012117  [CONN-TH_XH-2A]  81 101.47 0 top
TXD  BLUE 3V  [LED0805-RD]  80.48 149.4 90 top
U1  SPEAKERS  [CONN-TH_C4255WV-2X12P]  46.82 39.18 90 top
WC1  47uF  [CAP-TH_BD6.3-P2.5-D0.5]  85.27 36.63 0 top
WC2  0.1uF  [C0805#2]  69.8 86.52 180 top
WC3  0.1uF  [C0805#2]  69.8 78.44 0 top
WC4  10uF  [C0805#2]  69.8 82.48 0 top
WU1  L7805  [TO-220-3_L10.0-W4.5-P2.54-L]  83.79 66.01 270 top
YAMAHA_TRIGGER_ON  BLUE 3V  [LED0805-RD]  87.48 101.68 90 top

## Footprints (pads in the part's own frame, mm; a bottom-side part is the same pattern mirrored in y, then rotated)
C0805
  rect 1.41x1.35 smd: 1(-1.03,0) 2(1.03,0)
C0805#2
  rect 1.41x1.35 smd: 1(-1,0) 2(1,0)
CAP-TH_BD6.3-P2.5-D0.5
  round 1.6 hole 0.9: 1(-1.25,0) 2(1.25,0)
CONN-TH_C4255WV-2X12P
  rect 2.8x2.8 hole 1.8: 1(23.1,-2.1)
  round 2.8 hole 1.8: 2(18.9,-2.1) 3(14.7,-2.1) 4(10.5,-2.1) 5(6.3,-2.1) 6(2.1,-2.1) 7(-2.1,-2.1) 8(-6.3,-2.1) 9(-10.5,-2.1) 10(-14.7,-2.1) 11(-18.9,-2.1) 12(23.1,2.1) 13(18.9,2.1) 14(14.7,2.1) 15(10.5,2.1) 16(6.3,2.1) 17(2.1,2.1) 18(-2.1,2.1) 19(-6.3,2.1) 20(-10.5,2.1) 21(-14.7,2.1) 22(-18.9,2.1) 23(-23.1,-2.1) 24(-23.1,2.1)
CONN-TH_KH-XH-4A-Z
  rect 1.8x1.8 hole 1.2: 1(-3.75,0)
  round 1.8 hole 1.2: 2(-1.25,0) 3(1.25,0) 4(3.75,0)
CONN-TH_XH-2A
  round 1.8 hole 1.1: 1(-1.251,0) 2(1.251,0)
CONN-TH_XH-6A
  rect 2x2 hole 1.2: 1(-6.25,0)
  round 2 hole 1.2: 2(-3.75,0) 3(-1.25,0) 4(1.25,0) 5(3.75,0) 6(6.25,0)
HDR-TH_6P-P2.54-V-M
  rect 1.7x1.7 hole 1.1: 1(-6.35,0)
  round 1.7 hole 1.1: 2(-3.81,0) 3(-1.27,0) 4(1.27,0) 5(3.81,0) 6(6.35,0)
LED0805-RD
  rect 1x1.25 smd: 1(-1.1,0) 2(1.1,0)
OPTO-SMD-4_L4.6-W6.5-P2.54-LS10.3-BL
  rect 1.5x3 smd: 1(-1.27,-5) 2(1.27,-5) 3(1.27,5) 4(-1.27,5)
OSC-SMD_3P-L3.2-W1.3-P1.2-L
  rect 0.65x1.7 smd: 1(-1.2,0) 3(1.2,0)
  rect 0.5x1.7 smd: 2(0,0)
POTENTIOMETER
  round 1.524 hole 0.914: 1(0,5.08) 2(-2.54,0) 3(2.54,0)
PUSH_BUTTON-SMD_4P
  rect 2.1x1.5 smd: 1(-2,-2.25) 2(2,-2.25) 3(2,2.25) 4(-2,2.25)
R0805
  rect 1.133x1.377 smd: 1(-1,0) 2(1,0)
RELAY-TH_JW2SN-DCXXV
  round 2.2 hole 1.3: 1(-12.5,-3.75) 2(2.5,-3.751) 3(7.5,-3.751) 4(12.5,-3.75) 5(12.5,3.751) 6(7.5,3.751) 7(2.5,3.751) 8(-12.5,3.751)
SMA_L4.3-W2.6-LS5.0-RD
  rect 2.046x1.62 smd: 1(-2.404,-0.009) 2(2.404,0.009)
SOT-23-3_L2.9-W1.3-P1.90-LS2.4-BR
  rect 1.25x0.7 smd: 1(1,-0.95) 2(1,0.95) 3(-1,0)
SOT-23-3_L2.9-W1.6-P1.90-LS2.8-BR
  rect 1.07x0.6 smd: 1(1.235,-0.95) 2(1.235,0.95) 3(-1.235,0)
TO-220-3_L10.0-W4.5-P2.54-L
  rect 1.8x2.6 hole 1.2: 1(-2.54,0.005)
  oval 1.8x2.6 hole 1.2: 2(0,0.005) 3(2.54,-0.005)
TQFP-32_L7.0-W7.0-P0.80-LS9.0-BL
  oval 0.45x1.65 smd: 1(-2.8,-4.369) 2(-2,-4.369) 3(-1.2,-4.369) 4(-0.4,-4.369) 5(0.4,-4.369) 6(1.2,-4.369) 7(2,-4.369) 8(2.8,-4.369) 17(2.8,4.369) 18(2,4.369) 19(1.2,4.369) 20(0.4,4.369) 21(-0.4,4.369) 22(-1.2,4.369) 23(-2,4.369) 24(-2.8,4.369)
  oval 1.65x0.45 smd: 9(4.381,-2.8) 10(4.381,-2) 11(4.381,-1.2) 12(4.381,-0.4) 13(4.381,0.4) 14(4.381,1.2) 15(4.381,2) 16(4.381,2.8) 25(-4.381,2.8) 26(-4.381,2) 27(-4.381,1.2) 28(-4.381,0.4) 29(-4.381,-0.4) 30(-4.381,-1.2) 31(-4.381,-2) 32(-4.381,-2.8)

## Nets
As in the schematic.

Pads without a net: AT1 17 19 20 22; AX1 2; MB_CANC 2 3; MB_MENU 2 3; MB_OK 2 3; RESET1 2 3; SERIAL 2 3; U1 6 8 9 10 15 16

## Copper pours and planes (outline as drawn; the poured copper is in the pictures)
GND on Bottom Layer: 0.66,163.17 95.68,163.17 95.68,-0.54 0.66,-0.54

## Text on the board
Top Silkscreen Layer: SPEAKERS | CANCEL | RESET | MENU | OK | SPEAKER RELAY ON | SPEAKERS TO / CAMBRIDGE | SPEAKER RIGHT | SPEAKER LEFT | BUTTONS | POWER | Speaker Switch v1.1 / Maciej Miklas | 9V-12V | GND | SUB | SUB TO CAMBRIDGE | SUB RELAY ON | YAMAHA / TRIGGER ON | YAMAHA 12V / TRIGGER | SUB LED | x | CPU RX | CPU TX | DTR | LCD / CONTRAST | LCD / BRIGHTNESS | SERIAL | CONNECTION: / TX -> CPU RX / RX -> CPU TX | SPEAKER LED
